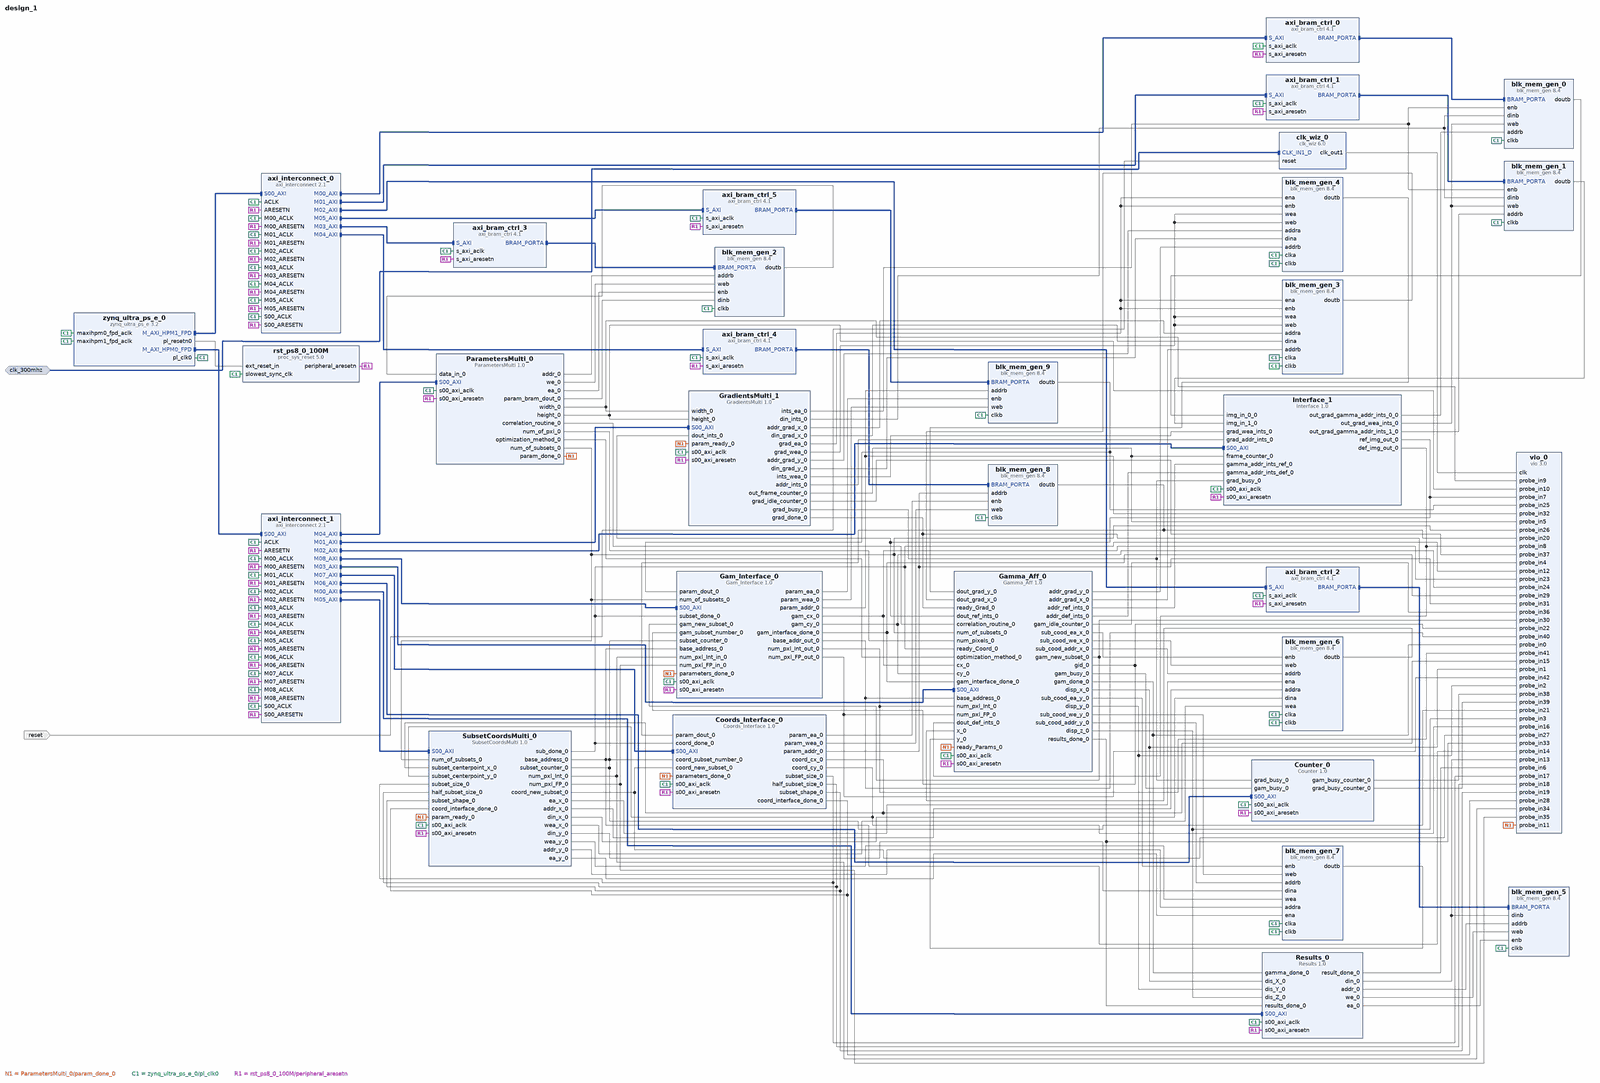
[diagram p0: block diagram of the top level, whole]
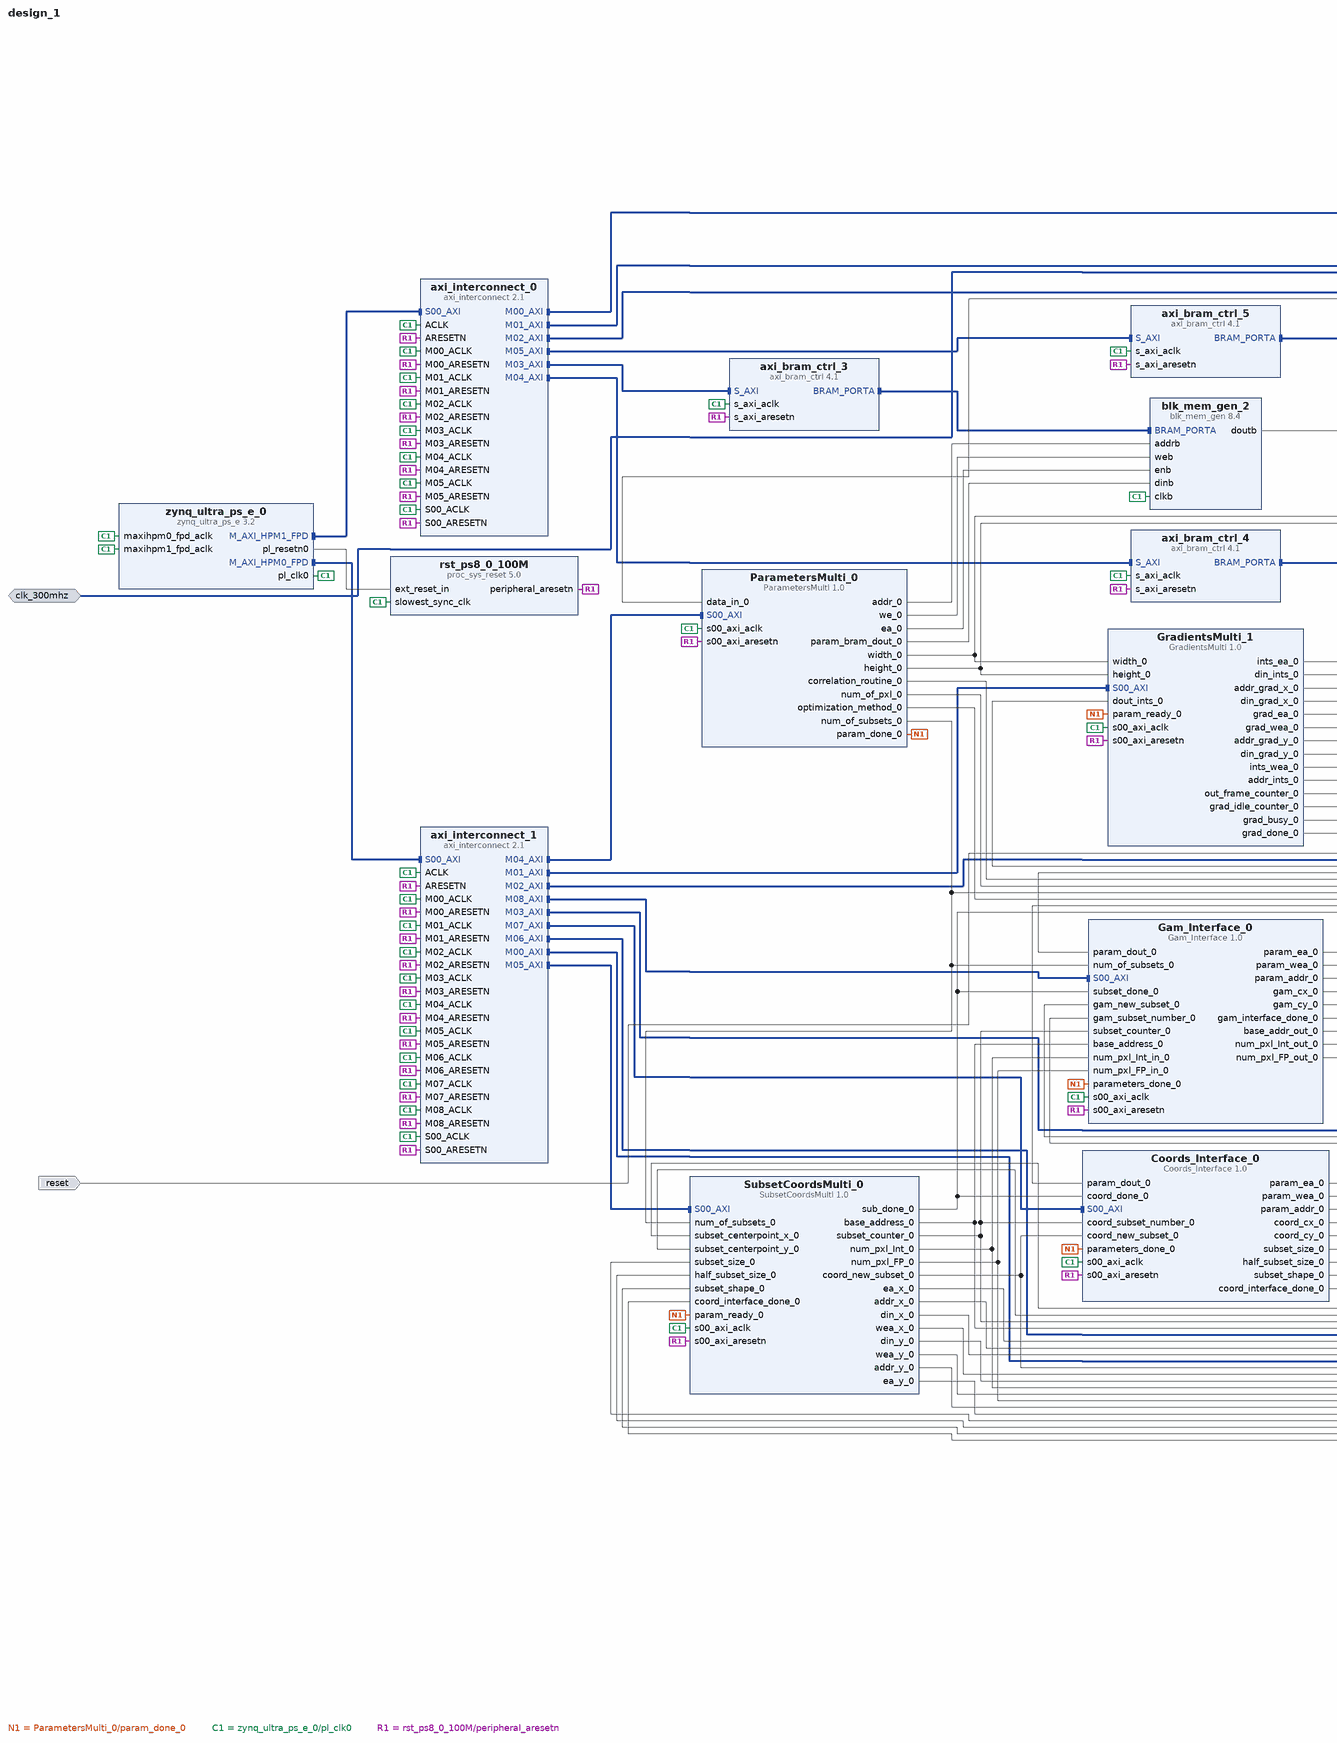
[diagram p1: block diagram of the top level, left part]
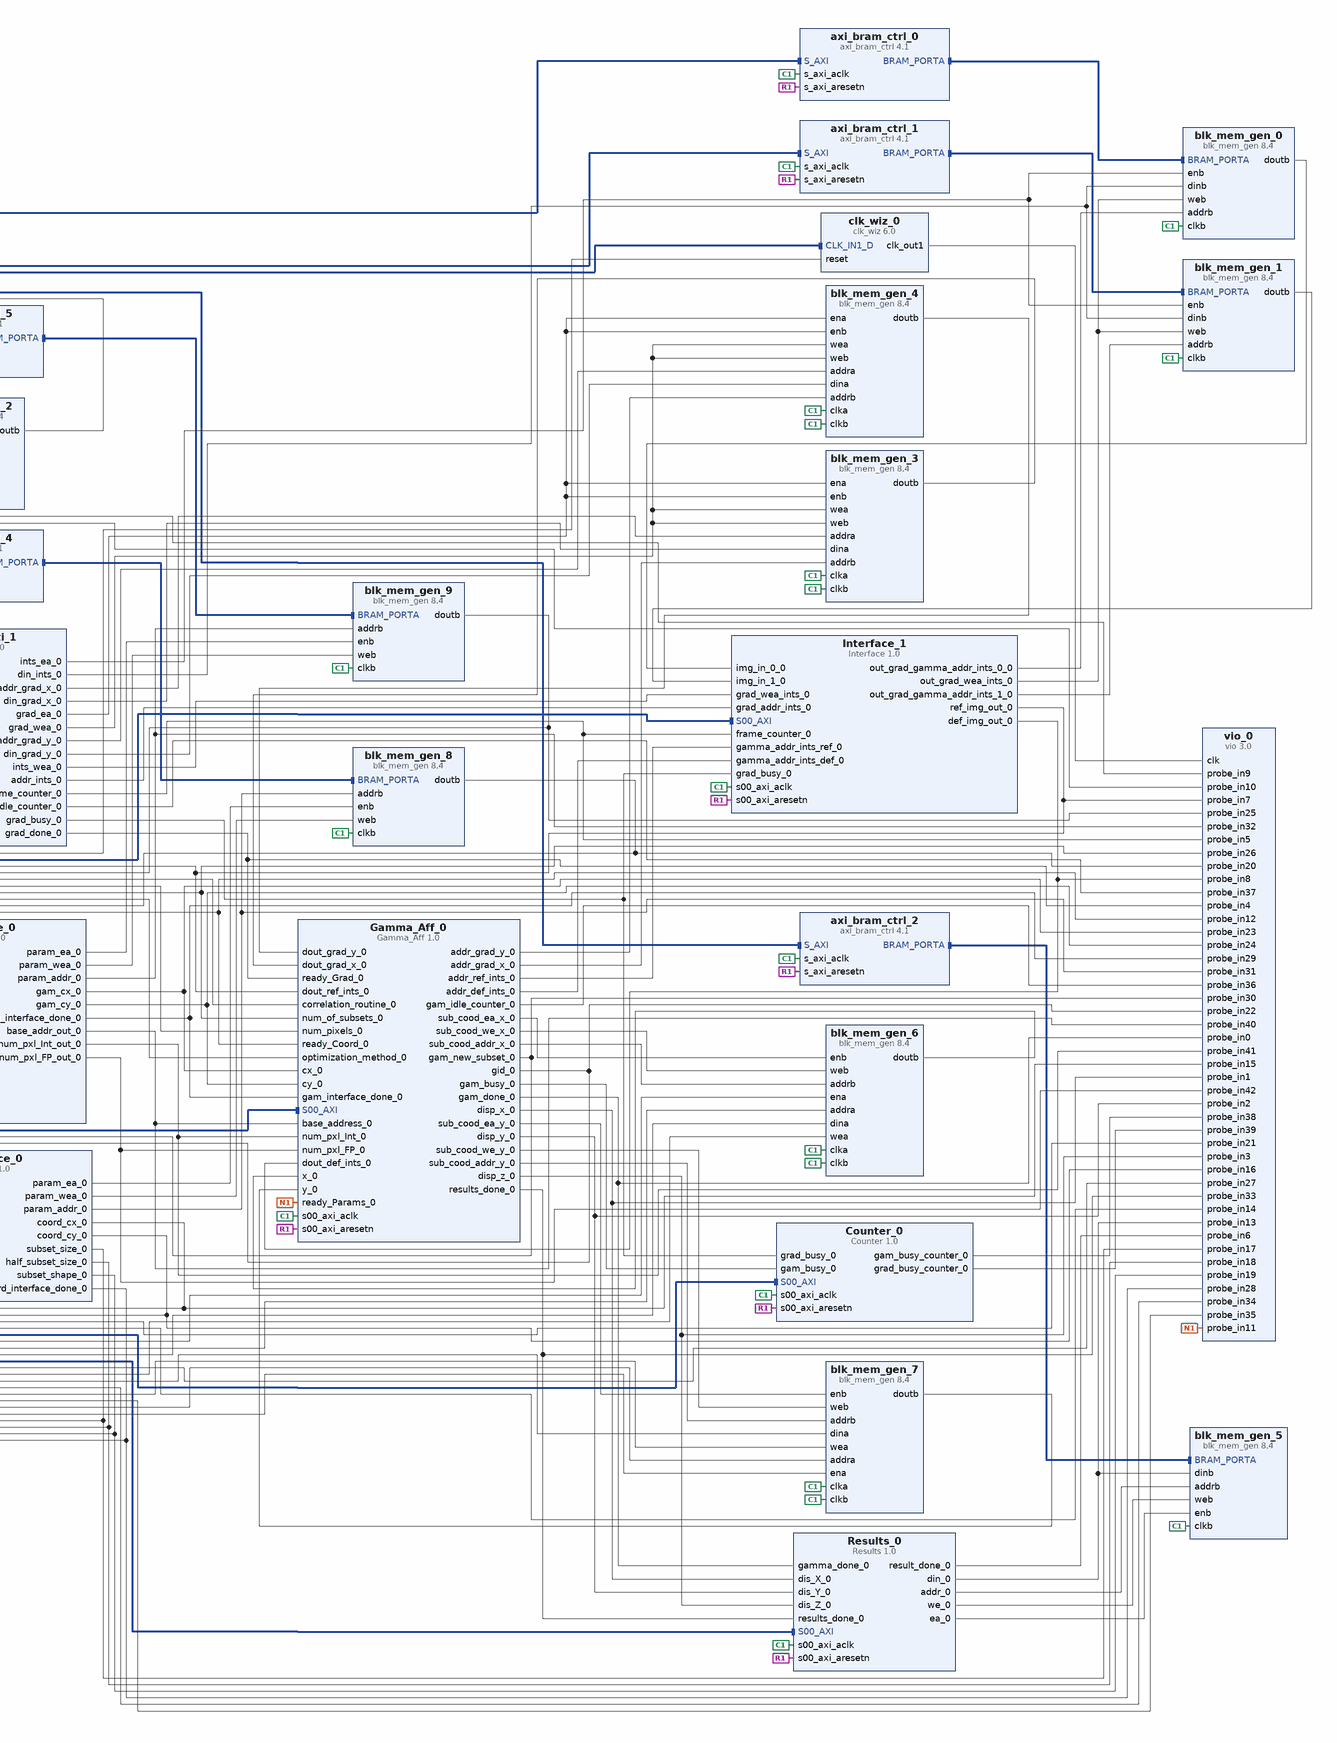
[diagram p2: block diagram of the top level, right part]
# Vivado block design design_1, xczu7ev-ffvc1156-2-e, Vivado 2018.3.1
create_bd_design design_1

create_bd_intf_port -mode Slave -vlnv xilinx.com:interface:diff_clock_rtl:1.0 clk_300mhz
set_property -dict {CONFIG.FREQ_HZ 300000000} [get_bd_intf_ports clk_300mhz]
create_bd_port -dir I -type rst reset
set_property -dict {CONFIG.POLARITY ACTIVE_HIGH} [get_bd_ports reset]

create_bd_cell -type ip -vlnv xilinx.com:ip:zynq_ultra_ps_e:3.2 zynq_ultra_ps_e_0
set_property -dict [list \
  CONFIG.PSU_BANK_0_IO_STANDARD LVCMOS18 \
  CONFIG.PSU_BANK_1_IO_STANDARD LVCMOS18 \
  CONFIG.PSU_BANK_2_IO_STANDARD LVCMOS18 \
  CONFIG.PSU__CAN1__PERIPHERAL__ENABLE 1 \
  CONFIG.PSU__CAN1__PERIPHERAL__IO {MIO 24 .. 25} \
  CONFIG.PSU__CRF_APB__ACPU_CTRL__FREQMHZ 1334 \
  CONFIG.PSU__CRF_APB__ACPU_CTRL__SRCSEL APLL \
  CONFIG.PSU__CRF_APB__APLL_CTRL__SRCSEL PSS_REF_CLK \
  CONFIG.PSU__CRF_APB__DBG_FPD_CTRL__FREQMHZ 250 \
  CONFIG.PSU__CRF_APB__DBG_FPD_CTRL__SRCSEL IOPLL \
  CONFIG.PSU__CRF_APB__DBG_TRACE_CTRL__FREQMHZ 250 \
  CONFIG.PSU__CRF_APB__DBG_TRACE_CTRL__SRCSEL IOPLL \
  CONFIG.PSU__CRF_APB__DBG_TSTMP_CTRL__FREQMHZ 250 \
  CONFIG.PSU__CRF_APB__DBG_TSTMP_CTRL__SRCSEL IOPLL \
  CONFIG.PSU__CRF_APB__DDR_CTRL__FREQMHZ 1067 \
  CONFIG.PSU__CRF_APB__DDR_CTRL__SRCSEL DPLL \
  CONFIG.PSU__CRF_APB__DPDMA_REF_CTRL__FREQMHZ 600 \
  CONFIG.PSU__CRF_APB__DPDMA_REF_CTRL__SRCSEL APLL \
  CONFIG.PSU__CRF_APB__DPLL_CTRL__SRCSEL PSS_REF_CLK \
  CONFIG.PSU__CRF_APB__DP_AUDIO_REF_CTRL__SRCSEL RPLL \
  CONFIG.PSU__CRF_APB__DP_STC_REF_CTRL__SRCSEL RPLL \
  CONFIG.PSU__CRF_APB__DP_VIDEO_REF_CTRL__SRCSEL VPLL \
  CONFIG.PSU__CRF_APB__GDMA_REF_CTRL__FREQMHZ 600 \
  CONFIG.PSU__CRF_APB__GDMA_REF_CTRL__SRCSEL APLL \
  CONFIG.PSU__CRF_APB__GPU_REF_CTRL__FREQMHZ 150 \
  CONFIG.PSU__CRF_APB__GPU_REF_CTRL__SRCSEL IOPLL \
  CONFIG.PSU__CRF_APB__TOPSW_LSBUS_CTRL__FREQMHZ 100 \
  CONFIG.PSU__CRF_APB__TOPSW_LSBUS_CTRL__SRCSEL IOPLL \
  CONFIG.PSU__CRF_APB__TOPSW_MAIN_CTRL__FREQMHZ 533.33 \
  CONFIG.PSU__CRF_APB__TOPSW_MAIN_CTRL__SRCSEL DPLL \
  CONFIG.PSU__CRF_APB__VPLL_CTRL__SRCSEL PSS_REF_CLK \
  CONFIG.PSU__CRL_APB__ADMA_REF_CTRL__FREQMHZ 500 \
  CONFIG.PSU__CRL_APB__ADMA_REF_CTRL__SRCSEL IOPLL \
  CONFIG.PSU__CRL_APB__CAN1_REF_CTRL__FREQMHZ 100 \
  CONFIG.PSU__CRL_APB__CAN1_REF_CTRL__SRCSEL IOPLL \
  CONFIG.PSU__CRL_APB__CPU_R5_CTRL__FREQMHZ 500 \
  CONFIG.PSU__CRL_APB__CPU_R5_CTRL__SRCSEL IOPLL \
  CONFIG.PSU__CRL_APB__DBG_LPD_CTRL__FREQMHZ 250 \
  CONFIG.PSU__CRL_APB__DBG_LPD_CTRL__SRCSEL IOPLL \
  CONFIG.PSU__CRL_APB__GEM3_REF_CTRL__FREQMHZ 125 \
  CONFIG.PSU__CRL_APB__GEM3_REF_CTRL__SRCSEL IOPLL \
  CONFIG.PSU__CRL_APB__I2C0_REF_CTRL__FREQMHZ 100 \
  CONFIG.PSU__CRL_APB__I2C0_REF_CTRL__SRCSEL IOPLL \
  CONFIG.PSU__CRL_APB__I2C1_REF_CTRL__FREQMHZ 100 \
  CONFIG.PSU__CRL_APB__I2C1_REF_CTRL__SRCSEL IOPLL \
  CONFIG.PSU__CRL_APB__IOPLL_CTRL__SRCSEL PSS_REF_CLK \
  CONFIG.PSU__CRL_APB__IOU_SWITCH_CTRL__FREQMHZ 250 \
  CONFIG.PSU__CRL_APB__IOU_SWITCH_CTRL__SRCSEL IOPLL \
  CONFIG.PSU__CRL_APB__LPD_LSBUS_CTRL__FREQMHZ 100 \
  CONFIG.PSU__CRL_APB__LPD_LSBUS_CTRL__SRCSEL IOPLL \
  CONFIG.PSU__CRL_APB__LPD_SWITCH_CTRL__FREQMHZ 500 \
  CONFIG.PSU__CRL_APB__LPD_SWITCH_CTRL__SRCSEL IOPLL \
  CONFIG.PSU__CRL_APB__PCAP_CTRL__FREQMHZ 200 \
  CONFIG.PSU__CRL_APB__PCAP_CTRL__SRCSEL IOPLL \
  CONFIG.PSU__CRL_APB__PL0_REF_CTRL__FREQMHZ 150 \
  CONFIG.PSU__CRL_APB__PL0_REF_CTRL__SRCSEL IOPLL \
  CONFIG.PSU__CRL_APB__QSPI_REF_CTRL__FREQMHZ 125 \
  CONFIG.PSU__CRL_APB__QSPI_REF_CTRL__SRCSEL IOPLL \
  CONFIG.PSU__CRL_APB__RPLL_CTRL__SRCSEL PSS_REF_CLK \
  CONFIG.PSU__CRL_APB__SDIO1_REF_CTRL__FREQMHZ 200 \
  CONFIG.PSU__CRL_APB__SDIO1_REF_CTRL__SRCSEL IOPLL \
  CONFIG.PSU__CRL_APB__TIMESTAMP_REF_CTRL__FREQMHZ 100 \
  CONFIG.PSU__CRL_APB__TIMESTAMP_REF_CTRL__SRCSEL IOPLL \
  CONFIG.PSU__CRL_APB__UART0_REF_CTRL__FREQMHZ 100 \
  CONFIG.PSU__CRL_APB__UART0_REF_CTRL__SRCSEL IOPLL \
  CONFIG.PSU__CRL_APB__UART1_REF_CTRL__FREQMHZ 100 \
  CONFIG.PSU__CRL_APB__UART1_REF_CTRL__SRCSEL IOPLL \
  CONFIG.PSU__CRL_APB__USB0_BUS_REF_CTRL__FREQMHZ 250 \
  CONFIG.PSU__CRL_APB__USB0_BUS_REF_CTRL__SRCSEL IOPLL \
  CONFIG.PSU__CRL_APB__USB3_DUAL_REF_CTRL__FREQMHZ 20 \
  CONFIG.PSU__CRL_APB__USB3_DUAL_REF_CTRL__SRCSEL IOPLL \
  CONFIG.PSU__CRL_APB__USB3__ENABLE 1 \
  CONFIG.PSU__DDRC__BUS_WIDTH {64 Bit} \
  CONFIG.PSU__DDRC__COMPONENTS Components \
  CONFIG.PSU__DDRC__DEVICE_CAPACITY {4096 MBits} \
  CONFIG.PSU__DDRC__DRAM_WIDTH {16 Bits} \
  CONFIG.PSU__DDRC__ECC Disabled \
  CONFIG.PSU__DDRC__MEMORY_TYPE {DDR 4} \
  CONFIG.PSU__DDRC__SPEED_BIN DDR4_2133P \
  CONFIG.PSU__DDR_HIGH_ADDRESS_GUI_ENABLE 0 \
  CONFIG.PSU__DDR__INTERFACE__FREQMHZ 533.500 \
  CONFIG.PSU__DISPLAYPORT__LANE0__ENABLE 1 \
  CONFIG.PSU__DISPLAYPORT__LANE0__IO {GT Lane1} \
  CONFIG.PSU__DISPLAYPORT__LANE1__ENABLE 1 \
  CONFIG.PSU__DISPLAYPORT__LANE1__IO {GT Lane0} \
  CONFIG.PSU__DISPLAYPORT__PERIPHERAL__ENABLE 1 \
  CONFIG.PSU__DLL__ISUSED 1 \
  CONFIG.PSU__DPAUX__PERIPHERAL__ENABLE 1 \
  CONFIG.PSU__DPAUX__PERIPHERAL__IO {MIO 27 .. 30} \
  CONFIG.PSU__DP__LANE_SEL {Dual Lower} \
  CONFIG.PSU__DP__REF_CLK_FREQ 27 \
  CONFIG.PSU__DP__REF_CLK_SEL {Ref Clk3} \
  CONFIG.PSU__ENET3__FIFO__ENABLE 0 \
  CONFIG.PSU__ENET3__GRP_MDIO__ENABLE 1 \
  CONFIG.PSU__ENET3__GRP_MDIO__IO {MIO 76 .. 77} \
  CONFIG.PSU__ENET3__PERIPHERAL__ENABLE 1 \
  CONFIG.PSU__ENET3__PERIPHERAL__IO {MIO 64 .. 75} \
  CONFIG.PSU__ENET3__PTP__ENABLE 0 \
  CONFIG.PSU__ENET3__TSU__ENABLE 0 \
  CONFIG.PSU__FPGA_PL0_ENABLE 1 \
  CONFIG.PSU__GEM3_COHERENCY 0 \
  CONFIG.PSU__GEM__TSU__ENABLE 0 \
  CONFIG.PSU__GPIO0_MIO__PERIPHERAL__ENABLE 0 \
  CONFIG.PSU__GPIO1_MIO__PERIPHERAL__ENABLE 0 \
  CONFIG.PSU__GT__LINK_SPEED HBR \
  CONFIG.PSU__GT__PRE_EMPH_LVL_4 0 \
  CONFIG.PSU__GT__VLT_SWNG_LVL_4 0 \
  CONFIG.PSU__I2C0__PERIPHERAL__ENABLE 0 \
  CONFIG.PSU__I2C1__PERIPHERAL__ENABLE 1 \
  CONFIG.PSU__I2C1__PERIPHERAL__IO {MIO 16 .. 17} \
  CONFIG.PSU__IOU_SLCR__IOU_TTC_APB_CLK__TTC0_SEL APB \
  CONFIG.PSU__IOU_SLCR__IOU_TTC_APB_CLK__TTC1_SEL APB \
  CONFIG.PSU__IOU_SLCR__IOU_TTC_APB_CLK__TTC2_SEL APB \
  CONFIG.PSU__IOU_SLCR__IOU_TTC_APB_CLK__TTC3_SEL APB \
  CONFIG.PSU__MAXIGP0__DATA_WIDTH 128 \
  CONFIG.PSU__OVERRIDE__BASIC_CLOCK 0 \
  CONFIG.PSU__PRESET_APPLIED 1 \
  CONFIG.PSU__PSS_REF_CLK__FREQMHZ 33.333333 \
  CONFIG.PSU__QSPI_COHERENCY 0 \
  CONFIG.PSU__QSPI__GRP_FBCLK__ENABLE 1 \
  CONFIG.PSU__QSPI__GRP_FBCLK__IO {MIO 6} \
  CONFIG.PSU__QSPI__PERIPHERAL__DATA_MODE x4 \
  CONFIG.PSU__QSPI__PERIPHERAL__ENABLE 1 \
  CONFIG.PSU__QSPI__PERIPHERAL__IO {MIO 0 .. 5} \
  CONFIG.PSU__QSPI__PERIPHERAL__MODE Single \
  CONFIG.PSU__SATA__LANE1__IO {GT Lane3} \
  CONFIG.PSU__SATA__PERIPHERAL__ENABLE 1 \
  CONFIG.PSU__SATA__REF_CLK_FREQ 125 \
  CONFIG.PSU__SATA__REF_CLK_SEL {Ref Clk1} \
  CONFIG.PSU__SD1_COHERENCY 0 \
  CONFIG.PSU__SD1__DATA_TRANSFER_MODE 4Bit \
  CONFIG.PSU__SD1__GRP_CD__ENABLE 1 \
  CONFIG.PSU__SD1__GRP_CD__IO {MIO 45} \
  CONFIG.PSU__SD1__GRP_POW__ENABLE 0 \
  CONFIG.PSU__SD1__GRP_WP__ENABLE 0 \
  CONFIG.PSU__SD1__PERIPHERAL__ENABLE 1 \
  CONFIG.PSU__SD1__PERIPHERAL__IO {MIO 46 .. 51} \
  CONFIG.PSU__SD1__SLOT_TYPE {SD 2.0} \
  CONFIG.PSU__SWDT0__CLOCK__ENABLE 0 \
  CONFIG.PSU__SWDT0__PERIPHERAL__ENABLE 1 \
  CONFIG.PSU__SWDT0__RESET__ENABLE 0 \
  CONFIG.PSU__SWDT1__CLOCK__ENABLE 0 \
  CONFIG.PSU__SWDT1__PERIPHERAL__ENABLE 1 \
  CONFIG.PSU__SWDT1__RESET__ENABLE 0 \
  CONFIG.PSU__TSU__BUFG_PORT_PAIR 0 \
  CONFIG.PSU__TTC0__CLOCK__ENABLE 0 \
  CONFIG.PSU__TTC0__PERIPHERAL__ENABLE 1 \
  CONFIG.PSU__TTC0__WAVEOUT__ENABLE 0 \
  CONFIG.PSU__TTC1__CLOCK__ENABLE 0 \
  CONFIG.PSU__TTC1__PERIPHERAL__ENABLE 1 \
  CONFIG.PSU__TTC1__WAVEOUT__ENABLE 0 \
  CONFIG.PSU__TTC2__CLOCK__ENABLE 0 \
  CONFIG.PSU__TTC2__PERIPHERAL__ENABLE 1 \
  CONFIG.PSU__TTC2__WAVEOUT__ENABLE 0 \
  CONFIG.PSU__TTC3__CLOCK__ENABLE 0 \
  CONFIG.PSU__TTC3__PERIPHERAL__ENABLE 1 \
  CONFIG.PSU__TTC3__WAVEOUT__ENABLE 0 \
  CONFIG.PSU__UART0__BAUD_RATE 115200 \
  CONFIG.PSU__UART0__MODEM__ENABLE 0 \
  CONFIG.PSU__UART0__PERIPHERAL__ENABLE 1 \
  CONFIG.PSU__UART0__PERIPHERAL__IO {MIO 18 .. 19} \
  CONFIG.PSU__UART1__BAUD_RATE 115200 \
  CONFIG.PSU__UART1__MODEM__ENABLE 0 \
  CONFIG.PSU__UART1__PERIPHERAL__ENABLE 1 \
  CONFIG.PSU__UART1__PERIPHERAL__IO {MIO 20 .. 21} \
  CONFIG.PSU__USB0_COHERENCY 0 \
  CONFIG.PSU__USB0__PERIPHERAL__ENABLE 1 \
  CONFIG.PSU__USB0__PERIPHERAL__IO {MIO 52 .. 63} \
  CONFIG.PSU__USB0__REF_CLK_FREQ 26 \
  CONFIG.PSU__USB0__REF_CLK_SEL {Ref Clk2} \
  CONFIG.PSU__USB2_0__EMIO__ENABLE 0 \
  CONFIG.PSU__USB3_0__EMIO__ENABLE 0 \
  CONFIG.PSU__USB3_0__PERIPHERAL__ENABLE 1 \
  CONFIG.PSU__USB3_0__PERIPHERAL__IO {GT Lane2} \
  CONFIG.PSU__USB__RESET__MODE {Boot Pin} \
  CONFIG.PSU__USB__RESET__POLARITY {Active Low} \
  CONFIG.PSU__USE__IRQ0 1 \
  CONFIG.PSU__USE__M_AXI_GP0 1 \
  CONFIG.PSU__USE__M_AXI_GP1 1 \
  CONFIG.PSU__USE__M_AXI_GP2 0 \
  CONFIG.SUBPRESET1 Custom \
] [get_bd_cells zynq_ultra_ps_e_0]
# 86 more settings of zynq_ultra_ps_e_0 are not shown: defaults, MIO pin electricals, DDR timing, and values the tool derives
create_bd_cell -type ip -vlnv xilinx.com:ip:axi_bram_ctrl:4.1 axi_bram_ctrl_0
set_property -dict {CONFIG.SINGLE_PORT_BRAM 1} [get_bd_cells axi_bram_ctrl_0]
create_bd_cell -type ip -vlnv xilinx.com:ip:axi_bram_ctrl:4.1 axi_bram_ctrl_1
set_property -dict {CONFIG.SINGLE_PORT_BRAM 1} [get_bd_cells axi_bram_ctrl_1]
create_bd_cell -type ip -vlnv xilinx.com:ip:axi_bram_ctrl:4.1 axi_bram_ctrl_2
set_property -dict {CONFIG.SINGLE_PORT_BRAM 1} [get_bd_cells axi_bram_ctrl_2]
create_bd_cell -type ip -vlnv xilinx.com:ip:axi_interconnect:2.1 axi_interconnect_0
set_property -dict {CONFIG.NUM_MI 6} [get_bd_cells axi_interconnect_0]
create_bd_cell -type ip -vlnv xilinx.com:ip:proc_sys_reset:5.0 rst_ps8_0_100M
create_bd_cell -type ip -vlnv xilinx.com:ip:clk_wiz:6.0 clk_wiz_0
set_property -dict [list \
  CONFIG.CLKOUT1_JITTER 93.717 \
  CONFIG.CLKOUT1_REQUESTED_OUT_FREQ 150.000 \
  CONFIG.CLK_IN1_BOARD_INTERFACE clk_300mhz \
  CONFIG.MMCM_CLKOUT0_DIVIDE_F 8.000 \
  CONFIG.MMCM_DIVCLK_DIVIDE 1 \
  CONFIG.RESET_BOARD_INTERFACE reset \
  CONFIG.USE_BOARD_FLOW true \
] [get_bd_cells clk_wiz_0]
create_bd_cell -type ip -vlnv xilinx.com:ip:blk_mem_gen:8.4 blk_mem_gen_0
set_property -dict [list \
  CONFIG.Memory_Type True_Dual_Port_RAM \
  CONFIG.PRIM_type_to_Implement URAM \
  CONFIG.Port_B_Clock 100 \
  CONFIG.Port_B_Enable_Rate 100 \
  CONFIG.Port_B_Write_Rate 50 \
  CONFIG.Use_RSTB_Pin true \
] [get_bd_cells blk_mem_gen_0]
create_bd_cell -type ip -vlnv xilinx.com:ip:blk_mem_gen:8.4 blk_mem_gen_1
set_property -dict [list \
  CONFIG.Memory_Type True_Dual_Port_RAM \
  CONFIG.PRIM_type_to_Implement URAM \
  CONFIG.Port_B_Clock 100 \
  CONFIG.Port_B_Enable_Rate 100 \
  CONFIG.Port_B_Write_Rate 50 \
  CONFIG.Use_RSTB_Pin true \
] [get_bd_cells blk_mem_gen_1]
create_bd_cell -type ip -vlnv xilinx.com:ip:blk_mem_gen:8.4 blk_mem_gen_3
set_property -dict [list \
  CONFIG.Assume_Synchronous_Clk true \
  CONFIG.Enable_32bit_Address false \
  CONFIG.Enable_B Use_ENB_Pin \
  CONFIG.Memory_Type True_Dual_Port_RAM \
  CONFIG.Operating_Mode_A NO_CHANGE \
  CONFIG.Operating_Mode_B NO_CHANGE \
  CONFIG.PRIM_type_to_Implement BRAM \
  CONFIG.Port_B_Clock 100 \
  CONFIG.Port_B_Enable_Rate 100 \
  CONFIG.Port_B_Write_Rate 50 \
  CONFIG.Register_PortA_Output_of_Memory_Primitives false \
  CONFIG.Register_PortB_Output_of_Memory_Primitives false \
  CONFIG.Use_Byte_Write_Enable false \
  CONFIG.Use_RSTA_Pin false \
  CONFIG.Write_Depth_A 103936 \
  CONFIG.use_bram_block Stand_Alone \
] [get_bd_cells blk_mem_gen_3]
create_bd_cell -type ip -vlnv xilinx.com:ip:blk_mem_gen:8.4 blk_mem_gen_4
set_property -dict [list \
  CONFIG.Assume_Synchronous_Clk true \
  CONFIG.Enable_32bit_Address false \
  CONFIG.Enable_B Use_ENB_Pin \
  CONFIG.Memory_Type True_Dual_Port_RAM \
  CONFIG.Operating_Mode_A NO_CHANGE \
  CONFIG.Operating_Mode_B NO_CHANGE \
  CONFIG.PRIM_type_to_Implement BRAM \
  CONFIG.Port_B_Clock 100 \
  CONFIG.Port_B_Enable_Rate 100 \
  CONFIG.Port_B_Write_Rate 50 \
  CONFIG.Register_PortA_Output_of_Memory_Primitives false \
  CONFIG.Register_PortB_Output_of_Memory_Primitives false \
  CONFIG.Use_Byte_Write_Enable false \
  CONFIG.Use_RSTA_Pin false \
  CONFIG.Write_Depth_A 103936 \
  CONFIG.use_bram_block Stand_Alone \
] [get_bd_cells blk_mem_gen_4]
create_bd_cell -type ip -vlnv xilinx.com:ip:blk_mem_gen:8.4 blk_mem_gen_5
set_property -dict [list \
  CONFIG.Memory_Type True_Dual_Port_RAM \
  CONFIG.PRIM_type_to_Implement URAM \
  CONFIG.Port_B_Clock 100 \
  CONFIG.Port_B_Enable_Rate 100 \
  CONFIG.Port_B_Write_Rate 50 \
  CONFIG.Use_RSTB_Pin true \
] [get_bd_cells blk_mem_gen_5]
create_bd_cell -type ip -vlnv xilinx.com:ip:blk_mem_gen:8.4 blk_mem_gen_6
set_property -dict [list \
  CONFIG.Enable_32bit_Address false \
  CONFIG.Enable_B Use_ENB_Pin \
  CONFIG.Memory_Type True_Dual_Port_RAM \
  CONFIG.Port_B_Clock 100 \
  CONFIG.Port_B_Enable_Rate 100 \
  CONFIG.Port_B_Write_Rate 50 \
  CONFIG.Register_PortA_Output_of_Memory_Primitives false \
  CONFIG.Register_PortB_Output_of_Memory_Primitives false \
  CONFIG.Use_Byte_Write_Enable false \
  CONFIG.Use_RSTA_Pin false \
  CONFIG.Write_Depth_A 48300 \
  CONFIG.use_bram_block Stand_Alone \
] [get_bd_cells blk_mem_gen_6]
create_bd_cell -type ip -vlnv xilinx.com:ip:blk_mem_gen:8.4 blk_mem_gen_7
set_property -dict [list \
  CONFIG.Enable_32bit_Address false \
  CONFIG.Enable_B Use_ENB_Pin \
  CONFIG.Memory_Type True_Dual_Port_RAM \
  CONFIG.Port_B_Clock 100 \
  CONFIG.Port_B_Enable_Rate 100 \
  CONFIG.Port_B_Write_Rate 50 \
  CONFIG.Register_PortA_Output_of_Memory_Primitives false \
  CONFIG.Register_PortB_Output_of_Memory_Primitives false \
  CONFIG.Use_Byte_Write_Enable false \
  CONFIG.Use_RSTA_Pin false \
  CONFIG.Write_Depth_A 48300 \
  CONFIG.use_bram_block Stand_Alone \
] [get_bd_cells blk_mem_gen_7]
create_bd_cell -type ip -vlnv xilinx.com:ip:vio:3.0 vio_0
set_property -dict {CONFIG.C_NUM_PROBE_IN 43 CONFIG.C_NUM_PROBE_OUT 0} [get_bd_cells vio_0]
create_bd_cell -type ip -vlnv xilinx.com:ip:axi_bram_ctrl:4.1 axi_bram_ctrl_3
set_property -dict {CONFIG.SINGLE_PORT_BRAM 1} [get_bd_cells axi_bram_ctrl_3]
create_bd_cell -type ip -vlnv xilinx.com:ip:blk_mem_gen:8.4 blk_mem_gen_2
set_property -dict [list \
  CONFIG.Assume_Synchronous_Clk false \
  CONFIG.EN_SAFETY_CKT true \
  CONFIG.Enable_B Use_ENB_Pin \
  CONFIG.Memory_Type True_Dual_Port_RAM \
  CONFIG.Operating_Mode_A WRITE_FIRST \
  CONFIG.Operating_Mode_B WRITE_FIRST \
  CONFIG.PRIM_type_to_Implement BRAM \
  CONFIG.Port_B_Clock 100 \
  CONFIG.Port_B_Enable_Rate 100 \
  CONFIG.Port_B_Write_Rate 50 \
  CONFIG.Use_RSTB_Pin true \
] [get_bd_cells blk_mem_gen_2]
create_bd_cell -type ip -vlnv xilinx.com:user:ParametersMulti:1.0 ParametersMulti_0
create_bd_cell -type ip -vlnv xilinx.com:ip:axi_bram_ctrl:4.1 axi_bram_ctrl_4
set_property -dict {CONFIG.SINGLE_PORT_BRAM 1} [get_bd_cells axi_bram_ctrl_4]
create_bd_cell -type ip -vlnv xilinx.com:ip:axi_bram_ctrl:4.1 axi_bram_ctrl_5
set_property -dict {CONFIG.SINGLE_PORT_BRAM 1} [get_bd_cells axi_bram_ctrl_5]
create_bd_cell -type ip -vlnv xilinx.com:ip:blk_mem_gen:8.4 blk_mem_gen_8
set_property -dict [list \
  CONFIG.Assume_Synchronous_Clk false \
  CONFIG.EN_SAFETY_CKT true \
  CONFIG.Enable_B Use_ENB_Pin \
  CONFIG.Memory_Type True_Dual_Port_RAM \
  CONFIG.Operating_Mode_A WRITE_FIRST \
  CONFIG.Operating_Mode_B WRITE_FIRST \
  CONFIG.PRIM_type_to_Implement BRAM \
  CONFIG.Port_B_Clock 100 \
  CONFIG.Port_B_Enable_Rate 100 \
  CONFIG.Port_B_Write_Rate 50 \
  CONFIG.Use_RSTB_Pin true \
] [get_bd_cells blk_mem_gen_8]
create_bd_cell -type ip -vlnv xilinx.com:ip:blk_mem_gen:8.4 blk_mem_gen_9
set_property -dict [list \
  CONFIG.Assume_Synchronous_Clk false \
  CONFIG.EN_SAFETY_CKT true \
  CONFIG.Enable_B Use_ENB_Pin \
  CONFIG.Memory_Type True_Dual_Port_RAM \
  CONFIG.Operating_Mode_A WRITE_FIRST \
  CONFIG.Operating_Mode_B WRITE_FIRST \
  CONFIG.PRIM_type_to_Implement BRAM \
  CONFIG.Port_B_Clock 100 \
  CONFIG.Port_B_Enable_Rate 100 \
  CONFIG.Port_B_Write_Rate 50 \
  CONFIG.Use_RSTB_Pin true \
] [get_bd_cells blk_mem_gen_9]
create_bd_cell -type ip -vlnv xilinx.com:user:Coords_Interface:1.0 Coords_Interface_0
create_bd_cell -type ip -vlnv xilinx.com:user:GradientsMulti:1.0 GradientsMulti_1
create_bd_cell -type ip -vlnv xilinx.com:user:Counter:1.0 Counter_0
create_bd_cell -type ip -vlnv xilinx.com:user:Gam_Interface:1.0 Gam_Interface_0
create_bd_cell -type ip -vlnv xilinx.com:user:SubsetCoordsMulti:1.0 SubsetCoordsMulti_0
create_bd_cell -type ip -vlnv xilinx.com:ip:axi_interconnect:2.1 axi_interconnect_1
set_property -dict {CONFIG.NUM_MI 9} [get_bd_cells axi_interconnect_1]
create_bd_cell -type ip -vlnv xilinx.com:user:Interface:1.0 Interface_1
create_bd_cell -type ip -vlnv xilinx.com:user:Results:1.0 Results_0
create_bd_cell -type ip -vlnv xilinx.com:user:Gamma_Aff:1.0 Gamma_Aff_0

# ---- connections ----

connect_bd_intf_net [get_bd_intf_pins blk_mem_gen_9/BRAM_PORTA] [get_bd_intf_pins axi_bram_ctrl_5/BRAM_PORTA]
connect_bd_intf_net [get_bd_intf_pins axi_bram_ctrl_2/S_AXI] [get_bd_intf_pins axi_interconnect_0/M02_AXI]
connect_bd_intf_net [get_bd_intf_pins axi_interconnect_1/M05_AXI] [get_bd_intf_pins SubsetCoordsMulti_0/S00_AXI]
connect_bd_intf_net [get_bd_intf_pins axi_interconnect_0/S00_AXI] [get_bd_intf_pins zynq_ultra_ps_e_0/M_AXI_HPM1_FPD]
connect_bd_intf_net [get_bd_intf_pins Counter_0/S00_AXI] [get_bd_intf_pins axi_interconnect_1/M06_AXI]
connect_bd_intf_net [get_bd_intf_pins axi_interconnect_1/M08_AXI] [get_bd_intf_pins Gam_Interface_0/S00_AXI]
connect_bd_intf_net [get_bd_intf_pins blk_mem_gen_8/BRAM_PORTA] [get_bd_intf_pins axi_bram_ctrl_4/BRAM_PORTA]
connect_bd_intf_net [get_bd_intf_pins zynq_ultra_ps_e_0/M_AXI_HPM0_FPD] [get_bd_intf_pins axi_interconnect_1/S00_AXI]
connect_bd_intf_net [get_bd_intf_pins axi_interconnect_1/M01_AXI] [get_bd_intf_pins GradientsMulti_1/S00_AXI]
connect_bd_intf_net [get_bd_intf_pins blk_mem_gen_0/BRAM_PORTA] [get_bd_intf_pins axi_bram_ctrl_0/BRAM_PORTA]
connect_bd_intf_net [get_bd_intf_pins axi_bram_ctrl_3/BRAM_PORTA] [get_bd_intf_pins blk_mem_gen_2/BRAM_PORTA]
connect_bd_intf_net [get_bd_intf_pins axi_bram_ctrl_3/S_AXI] [get_bd_intf_pins axi_interconnect_0/M03_AXI]
connect_bd_intf_net [get_bd_intf_pins axi_bram_ctrl_5/S_AXI] [get_bd_intf_pins axi_interconnect_0/M05_AXI]
connect_bd_intf_net [get_bd_intf_pins blk_mem_gen_1/BRAM_PORTA] [get_bd_intf_pins axi_bram_ctrl_1/BRAM_PORTA]
connect_bd_intf_net [get_bd_intf_ports clk_300mhz] [get_bd_intf_pins clk_wiz_0/CLK_IN1_D]
connect_bd_intf_net [get_bd_intf_pins axi_bram_ctrl_4/S_AXI] [get_bd_intf_pins axi_interconnect_0/M04_AXI]
connect_bd_intf_net [get_bd_intf_pins axi_bram_ctrl_0/S_AXI] [get_bd_intf_pins axi_interconnect_0/M00_AXI]
connect_bd_intf_net [get_bd_intf_pins axi_bram_ctrl_1/S_AXI] [get_bd_intf_pins axi_interconnect_0/M01_AXI]
connect_bd_intf_net [get_bd_intf_pins axi_interconnect_1/M04_AXI] [get_bd_intf_pins ParametersMulti_0/S00_AXI]
connect_bd_intf_net [get_bd_intf_pins axi_interconnect_1/M00_AXI] [get_bd_intf_pins Results_0/S00_AXI]
connect_bd_intf_net [get_bd_intf_pins blk_mem_gen_5/BRAM_PORTA] [get_bd_intf_pins axi_bram_ctrl_2/BRAM_PORTA]
connect_bd_intf_net [get_bd_intf_pins Interface_1/S00_AXI] [get_bd_intf_pins axi_interconnect_1/M02_AXI]
connect_bd_intf_net [get_bd_intf_pins axi_interconnect_1/M07_AXI] [get_bd_intf_pins Coords_Interface_0/S00_AXI]
connect_bd_intf_net [get_bd_intf_pins axi_interconnect_1/M03_AXI] [get_bd_intf_pins Gamma_Aff_0/S00_AXI]
connect_bd_net [get_bd_pins zynq_ultra_ps_e_0/pl_resetn0] [get_bd_pins rst_ps8_0_100M/ext_reset_in]
connect_bd_net [get_bd_ports reset] [get_bd_pins clk_wiz_0/reset]
connect_bd_net [get_bd_pins Results_0/addr_0] [get_bd_pins blk_mem_gen_5/addrb]
connect_bd_net [get_bd_pins Results_0/we_0] [get_bd_pins blk_mem_gen_5/web]
connect_bd_net [get_bd_pins blk_mem_gen_0/doutb] [get_bd_pins Interface_1/img_in_0_0]
connect_bd_net [get_bd_pins blk_mem_gen_1/doutb] [get_bd_pins Interface_1/img_in_1_0]
connect_bd_net [get_bd_pins Results_0/din_0] [get_bd_pins blk_mem_gen_5/dinb] [get_bd_pins vio_0/probe_in13]
connect_bd_net [get_bd_pins GradientsMulti_1/grad_ea_0] \
  [get_bd_pins blk_mem_gen_3/ena] [get_bd_pins blk_mem_gen_3/enb] [get_bd_pins blk_mem_gen_4/ena] \
  [get_bd_pins blk_mem_gen_4/enb]
connect_bd_net [get_bd_pins GradientsMulti_1/out_frame_counter_0] [get_bd_pins vio_0/probe_in5] [get_bd_pins Interface_1/frame_counter_0]
connect_bd_net [get_bd_pins GradientsMulti_1/grad_done_0] [get_bd_pins vio_0/probe_in4] [get_bd_pins Gamma_Aff_0/ready_Grad_0]
connect_bd_net [get_bd_pins GradientsMulti_1/ints_ea_0] [get_bd_pins blk_mem_gen_0/enb] [get_bd_pins blk_mem_gen_1/enb]
connect_bd_net [get_bd_pins GradientsMulti_1/grad_wea_0] \
  [get_bd_pins blk_mem_gen_3/web] [get_bd_pins blk_mem_gen_3/wea] [get_bd_pins blk_mem_gen_4/web] \
  [get_bd_pins blk_mem_gen_4/wea]
connect_bd_net [get_bd_pins GradientsMulti_1/ints_wea_0] [get_bd_pins Interface_1/grad_wea_ints_0]
connect_bd_net [get_bd_pins GradientsMulti_1/addr_ints_0] [get_bd_pins Interface_1/grad_addr_ints_0]
connect_bd_net [get_bd_pins GradientsMulti_1/addr_grad_x_0] [get_bd_pins blk_mem_gen_3/addra]
connect_bd_net [get_bd_pins GradientsMulti_1/addr_grad_y_0] [get_bd_pins blk_mem_gen_4/addra]
connect_bd_net [get_bd_pins GradientsMulti_1/din_grad_x_0] [get_bd_pins blk_mem_gen_3/dina]
connect_bd_net [get_bd_pins GradientsMulti_1/din_grad_y_0] [get_bd_pins blk_mem_gen_4/dina]
connect_bd_net [get_bd_pins GradientsMulti_1/din_ints_0] [get_bd_pins blk_mem_gen_0/dinb] [get_bd_pins blk_mem_gen_1/dinb]
connect_bd_net [get_bd_pins ParametersMulti_0/width_0] [get_bd_pins vio_0/probe_in9] [get_bd_pins GradientsMulti_1/width_0]
connect_bd_net [get_bd_pins ParametersMulti_0/height_0] [get_bd_pins vio_0/probe_in10] [get_bd_pins GradientsMulti_1/height_0]
connect_bd_net [get_bd_pins ParametersMulti_0/param_done_0] \
  [get_bd_pins vio_0/probe_in11] [get_bd_pins Coords_Interface_0/parameters_done_0] \
  [get_bd_pins GradientsMulti_1/param_ready_0] [get_bd_pins Gam_Interface_0/parameters_done_0] \
  [get_bd_pins SubsetCoordsMulti_0/param_ready_0] [get_bd_pins Gamma_Aff_0/ready_Params_0]
connect_bd_net [get_bd_pins ParametersMulti_0/num_of_subsets_0] \
  [get_bd_pins vio_0/probe_in26] [get_bd_pins Gam_Interface_0/num_of_subsets_0] \
  [get_bd_pins SubsetCoordsMulti_0/num_of_subsets_0] [get_bd_pins Gamma_Aff_0/num_of_subsets_0]
connect_bd_net [get_bd_pins SubsetCoordsMulti_0/sub_done_0] \
  [get_bd_pins vio_0/probe_in12] [get_bd_pins Coords_Interface_0/coord_done_0] [get_bd_pins Gam_Interface_0/subset_done_0] \
  [get_bd_pins Gamma_Aff_0/ready_Coord_0]
connect_bd_net [get_bd_pins Results_0/ea_0] [get_bd_pins blk_mem_gen_5/enb]
connect_bd_net [get_bd_pins clk_wiz_0/clk_out1] [get_bd_pins vio_0/clk]
connect_bd_net [get_bd_pins Results_0/result_done_0] [get_bd_pins vio_0/probe_in6]
connect_bd_net [get_bd_pins ParametersMulti_0/addr_0] [get_bd_pins blk_mem_gen_2/addrb]
connect_bd_net [get_bd_pins ParametersMulti_0/we_0] [get_bd_pins blk_mem_gen_2/web]
connect_bd_net [get_bd_pins ParametersMulti_0/ea_0] [get_bd_pins blk_mem_gen_2/enb]
connect_bd_net [get_bd_pins blk_mem_gen_2/doutb] [get_bd_pins ParametersMulti_0/data_in_0]
connect_bd_net [get_bd_pins ParametersMulti_0/param_bram_dout_0] [get_bd_pins blk_mem_gen_2/dinb]
connect_bd_net [get_bd_pins SubsetCoordsMulti_0/coord_new_subset_0] [get_bd_pins vio_0/probe_in27] [get_bd_pins Coords_Interface_0/coord_new_subset_0]
connect_bd_net [get_bd_pins SubsetCoordsMulti_0/subset_counter_0] \
  [get_bd_pins vio_0/probe_in21] [get_bd_pins Coords_Interface_0/coord_subset_number_0] \
  [get_bd_pins Gam_Interface_0/subset_counter_0]
connect_bd_net [get_bd_pins blk_mem_gen_8/doutb] [get_bd_pins vio_0/probe_in20] [get_bd_pins Coords_Interface_0/param_dout_0]
connect_bd_net [get_bd_pins blk_mem_gen_9/doutb] [get_bd_pins vio_0/probe_in25] [get_bd_pins Gam_Interface_0/param_dout_0]
connect_bd_net [get_bd_pins SubsetCoordsMulti_0/base_address_0] [get_bd_pins vio_0/probe_in14] [get_bd_pins Gam_Interface_0/base_address_0]
connect_bd_net [get_bd_pins Coords_Interface_0/param_ea_0] [get_bd_pins blk_mem_gen_8/enb]
connect_bd_net [get_bd_pins Coords_Interface_0/param_wea_0] [get_bd_pins blk_mem_gen_8/web]
connect_bd_net [get_bd_pins Coords_Interface_0/param_addr_0] [get_bd_pins blk_mem_gen_8/addrb] [get_bd_pins vio_0/probe_in31]
connect_bd_net [get_bd_pins Coords_Interface_0/coord_cx_0] [get_bd_pins vio_0/probe_in15] [get_bd_pins SubsetCoordsMulti_0/subset_centerpoint_x_0]
connect_bd_net [get_bd_pins Coords_Interface_0/coord_cy_0] [get_bd_pins vio_0/probe_in16] [get_bd_pins SubsetCoordsMulti_0/subset_centerpoint_y_0]
connect_bd_net [get_bd_pins Coords_Interface_0/subset_size_0] [get_bd_pins vio_0/probe_in17] [get_bd_pins SubsetCoordsMulti_0/subset_size_0]
connect_bd_net [get_bd_pins Coords_Interface_0/half_subset_size_0] [get_bd_pins vio_0/probe_in18] [get_bd_pins SubsetCoordsMulti_0/half_subset_size_0]
connect_bd_net [get_bd_pins Coords_Interface_0/subset_shape_0] [get_bd_pins vio_0/probe_in19] [get_bd_pins SubsetCoordsMulti_0/subset_shape_0]
connect_bd_net [get_bd_pins Coords_Interface_0/coord_interface_done_0] \
  [get_bd_pins vio_0/probe_in28] [get_bd_pins SubsetCoordsMulti_0/coord_interface_done_0]
connect_bd_net [get_bd_pins Gam_Interface_0/param_ea_0] [get_bd_pins blk_mem_gen_9/enb]
connect_bd_net [get_bd_pins Gam_Interface_0/param_wea_0] [get_bd_pins blk_mem_gen_9/web]
connect_bd_net [get_bd_pins Gam_Interface_0/param_addr_0] [get_bd_pins blk_mem_gen_9/addrb] [get_bd_pins vio_0/probe_in32]
connect_bd_net [get_bd_pins Gam_Interface_0/gam_cx_0] [get_bd_pins vio_0/probe_in23] [get_bd_pins Gamma_Aff_0/cx_0]
connect_bd_net [get_bd_pins Gam_Interface_0/gam_cy_0] [get_bd_pins vio_0/probe_in24] [get_bd_pins Gamma_Aff_0/cy_0]
connect_bd_net [get_bd_pins Gam_Interface_0/gam_interface_done_0] [get_bd_pins vio_0/probe_in29] [get_bd_pins Gamma_Aff_0/gam_interface_done_0]
connect_bd_net [get_bd_pins Gam_Interface_0/base_addr_out_0] [get_bd_pins vio_0/probe_in40] [get_bd_pins Gamma_Aff_0/base_address_0]
connect_bd_net [get_bd_pins Gam_Interface_0/num_pxl_Int_out_0] [get_bd_pins vio_0/probe_in41] [get_bd_pins Gamma_Aff_0/num_pxl_Int_0]
connect_bd_net [get_bd_pins Gam_Interface_0/num_pxl_FP_out_0] [get_bd_pins vio_0/probe_in42] [get_bd_pins Gamma_Aff_0/num_pxl_FP_0]
connect_bd_net [get_bd_pins SubsetCoordsMulti_0/num_pxl_Int_0] [get_bd_pins vio_0/probe_in34] [get_bd_pins Gam_Interface_0/num_pxl_Int_in_0]
connect_bd_net [get_bd_pins SubsetCoordsMulti_0/num_pxl_FP_0] [get_bd_pins vio_0/probe_in35] [get_bd_pins Gam_Interface_0/num_pxl_FP_in_0]
connect_bd_net [get_bd_pins GradientsMulti_1/grad_busy_0] [get_bd_pins Counter_0/grad_busy_0] [get_bd_pins Interface_1/grad_busy_0]
connect_bd_net [get_bd_pins GradientsMulti_1/grad_idle_counter_0] [get_bd_pins vio_0/probe_in37]
connect_bd_net [get_bd_pins Counter_0/gam_busy_counter_0] [get_bd_pins vio_0/probe_in38]
connect_bd_net [get_bd_pins Counter_0/grad_busy_counter_0] [get_bd_pins vio_0/probe_in39]
connect_bd_net [get_bd_pins blk_mem_gen_3/doutb] [get_bd_pins Gamma_Aff_0/dout_grad_x_0]
connect_bd_net [get_bd_pins blk_mem_gen_6/doutb] [get_bd_pins Gamma_Aff_0/x_0]
connect_bd_net [get_bd_pins blk_mem_gen_4/doutb] [get_bd_pins Gamma_Aff_0/dout_grad_y_0]
connect_bd_net [get_bd_pins ParametersMulti_0/correlation_routine_0] [get_bd_pins Gamma_Aff_0/correlation_routine_0]
connect_bd_net [get_bd_pins ParametersMulti_0/num_of_pxl_0] [get_bd_pins Gamma_Aff_0/num_pixels_0]
connect_bd_net [get_bd_pins blk_mem_gen_7/doutb] [get_bd_pins Gamma_Aff_0/y_0]
connect_bd_net [get_bd_pins ParametersMulti_0/optimization_method_0] [get_bd_pins Gamma_Aff_0/optimization_method_0]
connect_bd_net [get_bd_pins SubsetCoordsMulti_0/ea_x_0] [get_bd_pins blk_mem_gen_6/ena]
connect_bd_net [get_bd_pins SubsetCoordsMulti_0/addr_x_0] [get_bd_pins blk_mem_gen_6/addra]
connect_bd_net [get_bd_pins SubsetCoordsMulti_0/din_y_0] [get_bd_pins blk_mem_gen_7/dina]
connect_bd_net [get_bd_pins SubsetCoordsMulti_0/wea_y_0] [get_bd_pins blk_mem_gen_7/wea]
connect_bd_net [get_bd_pins SubsetCoordsMulti_0/addr_y_0] [get_bd_pins blk_mem_gen_7/addra]
connect_bd_net [get_bd_pins SubsetCoordsMulti_0/din_x_0] [get_bd_pins blk_mem_gen_6/dina]
connect_bd_net [get_bd_pins SubsetCoordsMulti_0/wea_x_0] [get_bd_pins blk_mem_gen_6/wea]
connect_bd_net [get_bd_pins SubsetCoordsMulti_0/ea_y_0] [get_bd_pins blk_mem_gen_7/ena]
connect_bd_net [get_bd_pins Gamma_Aff_0/sub_cood_ea_x_0] [get_bd_pins blk_mem_gen_6/enb]
connect_bd_net [get_bd_pins Gamma_Aff_0/sub_cood_ea_y_0] [get_bd_pins blk_mem_gen_7/enb]
connect_bd_net [get_bd_pins Gamma_Aff_0/sub_cood_we_x_0] [get_bd_pins blk_mem_gen_6/web]
connect_bd_net [get_bd_pins Gamma_Aff_0/sub_cood_we_y_0] [get_bd_pins blk_mem_gen_7/web]
connect_bd_net [get_bd_pins Gamma_Aff_0/sub_cood_addr_x_0] [get_bd_pins blk_mem_gen_6/addrb]
connect_bd_net [get_bd_pins Gamma_Aff_0/sub_cood_addr_y_0] [get_bd_pins blk_mem_gen_7/addrb]
connect_bd_net [get_bd_pins Gamma_Aff_0/addr_ref_ints_0] [get_bd_pins Interface_1/gamma_addr_ints_ref_0]
connect_bd_net [get_bd_pins Gamma_Aff_0/addr_def_ints_0] [get_bd_pins Interface_1/gamma_addr_ints_def_0]
connect_bd_net [get_bd_pins Gamma_Aff_0/addr_grad_x_0] [get_bd_pins blk_mem_gen_3/addrb]
connect_bd_net [get_bd_pins Gamma_Aff_0/addr_grad_y_0] [get_bd_pins blk_mem_gen_4/addrb]
connect_bd_net [get_bd_pins Gamma_Aff_0/gam_done_0] [get_bd_pins vio_0/probe_in0] [get_bd_pins Results_0/gamma_done_0]
connect_bd_net [get_bd_pins Gamma_Aff_0/disp_x_0] [get_bd_pins vio_0/probe_in1] [get_bd_pins Results_0/dis_X_0]
connect_bd_net [get_bd_pins Gamma_Aff_0/disp_y_0] [get_bd_pins vio_0/probe_in2] [get_bd_pins Results_0/dis_Y_0]
connect_bd_net [get_bd_pins Gamma_Aff_0/disp_z_0] [get_bd_pins vio_0/probe_in3] [get_bd_pins Results_0/dis_Z_0]
connect_bd_net [get_bd_pins Gamma_Aff_0/gam_new_subset_0] [get_bd_pins Gam_Interface_0/gam_new_subset_0] [get_bd_pins vio_0/probe_in30]
connect_bd_net [get_bd_pins Gamma_Aff_0/gid_0] [get_bd_pins Gam_Interface_0/gam_subset_number_0] [get_bd_pins vio_0/probe_in22]
connect_bd_net [get_bd_pins Gamma_Aff_0/results_done_0] [get_bd_pins vio_0/probe_in33] [get_bd_pins Results_0/results_done_0]
connect_bd_net [get_bd_pins Gamma_Aff_0/gam_idle_counter_0] [get_bd_pins vio_0/probe_in36]
connect_bd_net [get_bd_pins Gamma_Aff_0/gam_busy_0] [get_bd_pins Counter_0/gam_busy_0]
connect_bd_net [get_bd_pins zynq_ultra_ps_e_0/pl_clk0] \
  [get_bd_pins zynq_ultra_ps_e_0/maxihpm0_fpd_aclk] [get_bd_pins axi_interconnect_1/S00_ACLK] \
  [get_bd_pins rst_ps8_0_100M/slowest_sync_clk] [get_bd_pins axi_interconnect_1/M03_ACLK] \
  [get_bd_pins axi_interconnect_1/ACLK] [get_bd_pins zynq_ultra_ps_e_0/maxihpm1_fpd_aclk] \
  [get_bd_pins axi_interconnect_0/S00_ACLK] [get_bd_pins axi_bram_ctrl_0/s_axi_aclk] \
  [get_bd_pins axi_interconnect_0/M00_ACLK] [get_bd_pins axi_bram_ctrl_1/s_axi_aclk] \
  [get_bd_pins axi_interconnect_0/M01_ACLK] [get_bd_pins axi_bram_ctrl_2/s_axi_aclk] \
  [get_bd_pins axi_interconnect_0/M02_ACLK] [get_bd_pins axi_interconnect_0/ACLK] [get_bd_pins axi_interconnect_0/M03_ACLK] \
  [get_bd_pins axi_bram_ctrl_3/s_axi_aclk] [get_bd_pins axi_interconnect_0/M04_ACLK] [get_bd_pins axi_bram_ctrl_4/s_axi_aclk] \
  [get_bd_pins axi_interconnect_0/M05_ACLK] [get_bd_pins axi_bram_ctrl_5/s_axi_aclk] \
  [get_bd_pins ParametersMulti_0/s00_axi_aclk] [get_bd_pins axi_interconnect_1/M04_ACLK] \
  [get_bd_pins axi_interconnect_1/M00_ACLK] [get_bd_pins Coords_Interface_0/s00_axi_aclk] \
  [get_bd_pins axi_interconnect_1/M07_ACLK] [get_bd_pins GradientsMulti_1/s00_axi_aclk] \
  [get_bd_pins axi_interconnect_1/M01_ACLK] [get_bd_pins Counter_0/s00_axi_aclk] [get_bd_pins axi_interconnect_1/M06_ACLK] \
  [get_bd_pins Gam_Interface_0/s00_axi_aclk] [get_bd_pins axi_interconnect_1/M08_ACLK] \
  [get_bd_pins SubsetCoordsMulti_0/s00_axi_aclk] [get_bd_pins axi_interconnect_1/M05_ACLK] \
  [get_bd_pins axi_interconnect_1/M02_ACLK] [get_bd_pins blk_mem_gen_0/clkb] [get_bd_pins blk_mem_gen_9/clkb] \
  [get_bd_pins blk_mem_gen_4/clka] [get_bd_pins blk_mem_gen_4/clkb] [get_bd_pins blk_mem_gen_1/clkb] \
  [get_bd_pins blk_mem_gen_3/clkb] [get_bd_pins blk_mem_gen_3/clka] [get_bd_pins blk_mem_gen_8/clkb] \
  [get_bd_pins blk_mem_gen_7/clkb] [get_bd_pins blk_mem_gen_7/clka] [get_bd_pins blk_mem_gen_5/clkb] \
  [get_bd_pins blk_mem_gen_6/clkb] [get_bd_pins blk_mem_gen_6/clka] [get_bd_pins Interface_1/s00_axi_aclk] \
  [get_bd_pins blk_mem_gen_2/clkb] [get_bd_pins Results_0/s00_axi_aclk] [get_bd_pins Gamma_Aff_0/s00_axi_aclk]
connect_bd_net [get_bd_pins rst_ps8_0_100M/peripheral_aresetn] \
  [get_bd_pins axi_interconnect_1/S00_ARESETN] [get_bd_pins axi_interconnect_1/M03_ARESETN] \
  [get_bd_pins axi_interconnect_1/ARESETN] [get_bd_pins axi_interconnect_0/S00_ARESETN] \
  [get_bd_pins axi_bram_ctrl_0/s_axi_aresetn] [get_bd_pins axi_interconnect_0/M00_ARESETN] \
  [get_bd_pins axi_bram_ctrl_1/s_axi_aresetn] [get_bd_pins axi_interconnect_0/M01_ARESETN] \
  [get_bd_pins axi_bram_ctrl_2/s_axi_aresetn] [get_bd_pins axi_interconnect_0/M02_ARESETN] \
  [get_bd_pins axi_interconnect_0/ARESETN] [get_bd_pins axi_interconnect_0/M03_ARESETN] \
  [get_bd_pins axi_bram_ctrl_3/s_axi_aresetn] [get_bd_pins axi_interconnect_0/M04_ARESETN] \
  [get_bd_pins axi_bram_ctrl_4/s_axi_aresetn] [get_bd_pins axi_interconnect_0/M05_ARESETN] \
  [get_bd_pins axi_bram_ctrl_5/s_axi_aresetn] [get_bd_pins ParametersMulti_0/s00_axi_aresetn] \
  [get_bd_pins axi_interconnect_1/M04_ARESETN] [get_bd_pins axi_interconnect_1/M00_ARESETN] \
  [get_bd_pins Coords_Interface_0/s00_axi_aresetn] [get_bd_pins axi_interconnect_1/M07_ARESETN] \
  [get_bd_pins GradientsMulti_1/s00_axi_aresetn] [get_bd_pins axi_interconnect_1/M01_ARESETN] \
  [get_bd_pins Counter_0/s00_axi_aresetn] [get_bd_pins axi_interconnect_1/M06_ARESETN] \
  [get_bd_pins Gam_Interface_0/s00_axi_aresetn] [get_bd_pins axi_interconnect_1/M08_ARESETN] \
  [get_bd_pins SubsetCoordsMulti_0/s00_axi_aresetn] [get_bd_pins axi_interconnect_1/M05_ARESETN] \
  [get_bd_pins axi_interconnect_1/M02_ARESETN] [get_bd_pins Interface_1/s00_axi_aresetn] \
  [get_bd_pins Results_0/s00_axi_aresetn] [get_bd_pins Gamma_Aff_0/s00_axi_aresetn]
connect_bd_net [get_bd_pins Interface_1/out_grad_gamma_addr_ints_1_0] [get_bd_pins blk_mem_gen_1/addrb]
connect_bd_net [get_bd_pins Interface_1/out_grad_gamma_addr_ints_0_0] [get_bd_pins blk_mem_gen_0/addrb]
connect_bd_net [get_bd_pins Interface_1/out_grad_wea_ints_0] [get_bd_pins blk_mem_gen_0/web] [get_bd_pins blk_mem_gen_1/web]
connect_bd_net [get_bd_pins Interface_1/def_img_out_0] [get_bd_pins vio_0/probe_in8] [get_bd_pins Gamma_Aff_0/dout_def_ints_0]
connect_bd_net [get_bd_pins Interface_1/ref_img_out_0] \
  [get_bd_pins GradientsMulti_1/dout_ints_0] [get_bd_pins vio_0/probe_in7] [get_bd_pins Gamma_Aff_0/dout_ref_ints_0]

# ---- address map ----
assign_bd_address -offset 0x00A0000000 -range 4K -target_address_space [get_bd_addr_spaces zynq_ultra_ps_e_0/Data] [get_bd_addr_segs Interface_1/S00_AXI/S00_AXI_reg]
assign_bd_address -offset 0x00A0001000 -range 4K -target_address_space [get_bd_addr_spaces zynq_ultra_ps_e_0/Data] [get_bd_addr_segs Gamma_Aff_0/S00_AXI/S00_AXI_reg]
assign_bd_address -offset 0x00A0002000 -range 4K -target_address_space [get_bd_addr_spaces zynq_ultra_ps_e_0/Data] [get_bd_addr_segs SubsetCoordsMulti_0/S00_AXI/S00_AXI_reg]
assign_bd_address -offset 0x00A0003000 -range 4K -target_address_space [get_bd_addr_spaces zynq_ultra_ps_e_0/Data] [get_bd_addr_segs ParametersMulti_0/S00_AXI/S00_AXI_reg]
assign_bd_address -offset 0x00A0004000 -range 4K -target_address_space [get_bd_addr_spaces zynq_ultra_ps_e_0/Data] [get_bd_addr_segs Results_0/S00_AXI/S00_AXI_reg]
assign_bd_address -offset 0x00A0005000 -range 4K -target_address_space [get_bd_addr_spaces zynq_ultra_ps_e_0/Data] [get_bd_addr_segs GradientsMulti_1/S00_AXI/S00_AXI_reg]
assign_bd_address -offset 0x00A0007000 -range 4K -target_address_space [get_bd_addr_spaces zynq_ultra_ps_e_0/Data] [get_bd_addr_segs Coords_Interface_0/S00_AXI/S00_AXI_reg]
assign_bd_address -offset 0x00A0008000 -range 4K -target_address_space [get_bd_addr_spaces zynq_ultra_ps_e_0/Data] [get_bd_addr_segs Gam_Interface_0/S00_AXI/S00_AXI_reg]
assign_bd_address -offset 0x00A0009000 -range 4K -target_address_space [get_bd_addr_spaces zynq_ultra_ps_e_0/Data] [get_bd_addr_segs Counter_0/S00_AXI/S00_AXI_reg]
assign_bd_address -offset 0x00B0000000 -range 512K -target_address_space [get_bd_addr_spaces zynq_ultra_ps_e_0/Data] [get_bd_addr_segs axi_bram_ctrl_0/S_AXI/Mem0]
assign_bd_address -offset 0x00B0080000 -range 512K -target_address_space [get_bd_addr_spaces zynq_ultra_ps_e_0/Data] [get_bd_addr_segs axi_bram_ctrl_1/S_AXI/Mem0]
assign_bd_address -offset 0x00B0100000 -range 512K -target_address_space [get_bd_addr_spaces zynq_ultra_ps_e_0/Data] [get_bd_addr_segs axi_bram_ctrl_2/S_AXI/Mem0]
assign_bd_address -offset 0x00B0180000 -range 4K -target_address_space [get_bd_addr_spaces zynq_ultra_ps_e_0/Data] [get_bd_addr_segs axi_bram_ctrl_3/S_AXI/Mem0]
assign_bd_address -offset 0x00B0181000 -range 4K -target_address_space [get_bd_addr_spaces zynq_ultra_ps_e_0/Data] [get_bd_addr_segs axi_bram_ctrl_4/S_AXI/Mem0]
assign_bd_address -offset 0x00B0182000 -range 4K -target_address_space [get_bd_addr_spaces zynq_ultra_ps_e_0/Data] [get_bd_addr_segs axi_bram_ctrl_5/S_AXI/Mem0]

validate_bd_design
save_bd_design
